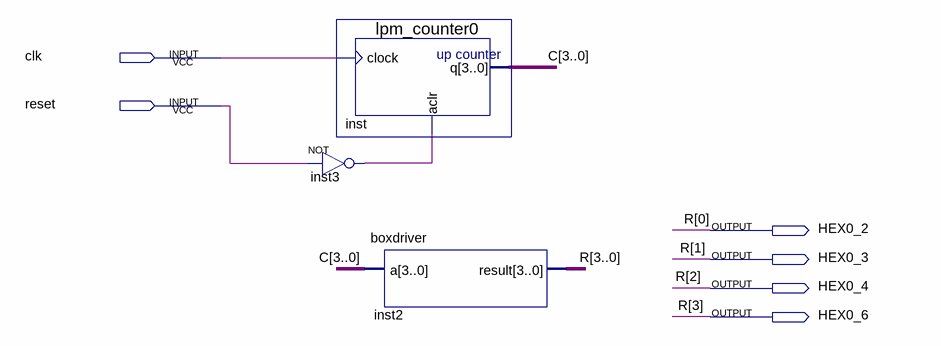
[diagram p0: schematic sheet]
// Quartus schematic flash.bdf as structural Verilog: 3 symbols, 6 pins
module flash (
  input  clk,
  input  reset,
  output HEX0_2,
  output HEX0_3,
  output HEX0_4,
  output HEX0_6
);

  wire inst3_out;
  wire [3:0] C;

  lpm_counter0 inst (.clock(clk), .aclr(inst3_out), .q(C));
  not inst3 (inst3_out, reset);
  boxdriver inst2 (.a(C), .result({HEX0_6, HEX0_4, HEX0_3, HEX0_2}));

  // Other names for the same wires on the sheet: R[3:0] = {HEX0_6, HEX0_4, HEX0_3, HEX0_2}
endmodule
